# Altium schematic sheet DiffAmp.schdoc: Analog Amplifier
size A4; Organization: Altium Limited; Address1: L3, 12a Rodborough Rd; Address2: Frenchs Forest; Address3: NSW; Address4: Australia 2086; DocumentNumber: 1; SheetNumber: 1; SheetTotal: 1
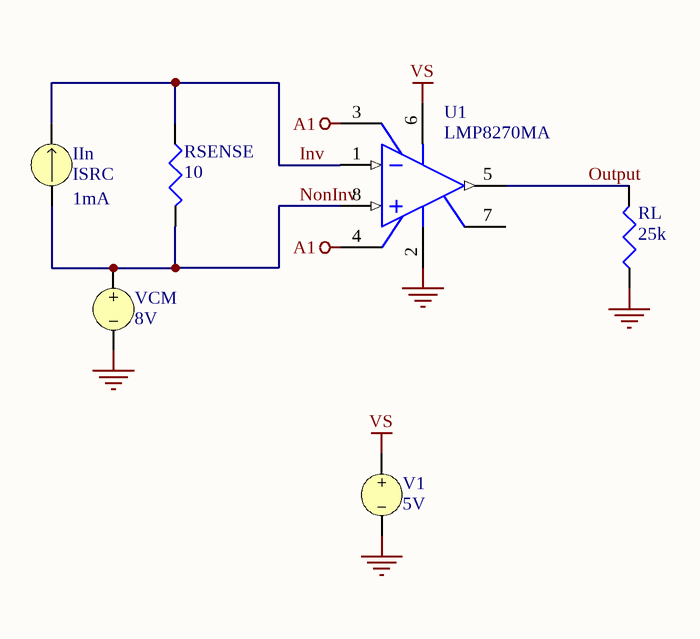
[diagram p0: DiffAmp.schdoc]

## Parts
IIn  ISRC  AC Magnitude: 1mA
RL  25k
RSENSE  value 10  (hidden comment: 10k)
U1  LMP8270MA  [M08A_N]
V1  value 5V  (hidden comment: 12V)
VCM  value 8V  (hidden comment: 12V)

## Nets
A1: U1.3(A1) U1.4(A2)
GND: RL.2(BOT) U1.2(GND) V1.2 VCM.2
VS: U1.6(VS) V1.1
Inv: IIn.2 RSENSE.2(BOT) U1.1(IN-)
NonInv: IIn.1 RSENSE.1(TOP) U1.8(IN+) VCM.1
Output: RL.1(TOP) U1.5(OUT)

Not connected (* = marked no-connect by the designer): U1 7(NC)

## Notes on the sheet
- Title
- Size:
- Date:
- A4
- Number:
- Time:
- Revision:
- Sheet
- of
- File:

## Library data of the parts
IIn = ISRC: Current Source; Note: PCB Footprint - Not required; Value: 1mA; Published: 8-Jun-2000; LatestRevisionDate: 17-Jul-2002; LatestRevisionNote: Re-released for DXP Platform.; PackageReference: Not Applicable; Publisher: Altium Limited
RL RSENSE = RES: Resistor
  RL: Value: 25k
U1 = LMP8270MA: High Common Mode, Gain of 20, Precision Voltage Difference Amplifier; Manufacturer: National Semiconductor; CompType: Amplifiers; PackageTopMarking: NSZXTT*LMP82*70MA; DeviceFunction: Differential Amplifier; Published: 4-Dec-2008; DatasheetVersion: Jan-2007; PackageVersion: revL, Sep-2006; PackageReference: M08A; Publisher: Altium Limited; PackageDescription: SOIC Narrow, 4.9 x 3.9 x 1.45mm, 8 Lead, 1.27mm Pitch; PartNumber: LMP8270MA; RoHS: Y; PinCount: 8; DigiKeyPartNumber: LMP8270MA-ND; Code_JEDEC: MS-012-AA; Code_IPC: SOIC127P600-8; ComponentLink1Description: LMP8270 Datasheet; ComponentLink1URL: http://www.national.com/ds/LM/LMP8270.pdf; ComponentLink2Description: LMP8270 Web Page; ComponentLink2URL: http://www.national.com/pf/LM/LMP8270.html; ComponentLink3Description: M08A Package Page; ComponentLink3URL: http://www.national.com/packaging/folders/m08a.html
V1 VCM = VSRC: Voltage Source